# EasyEDA schematic DualGreenHat_schematic.json

## Sheets
1 Power and S3Bat
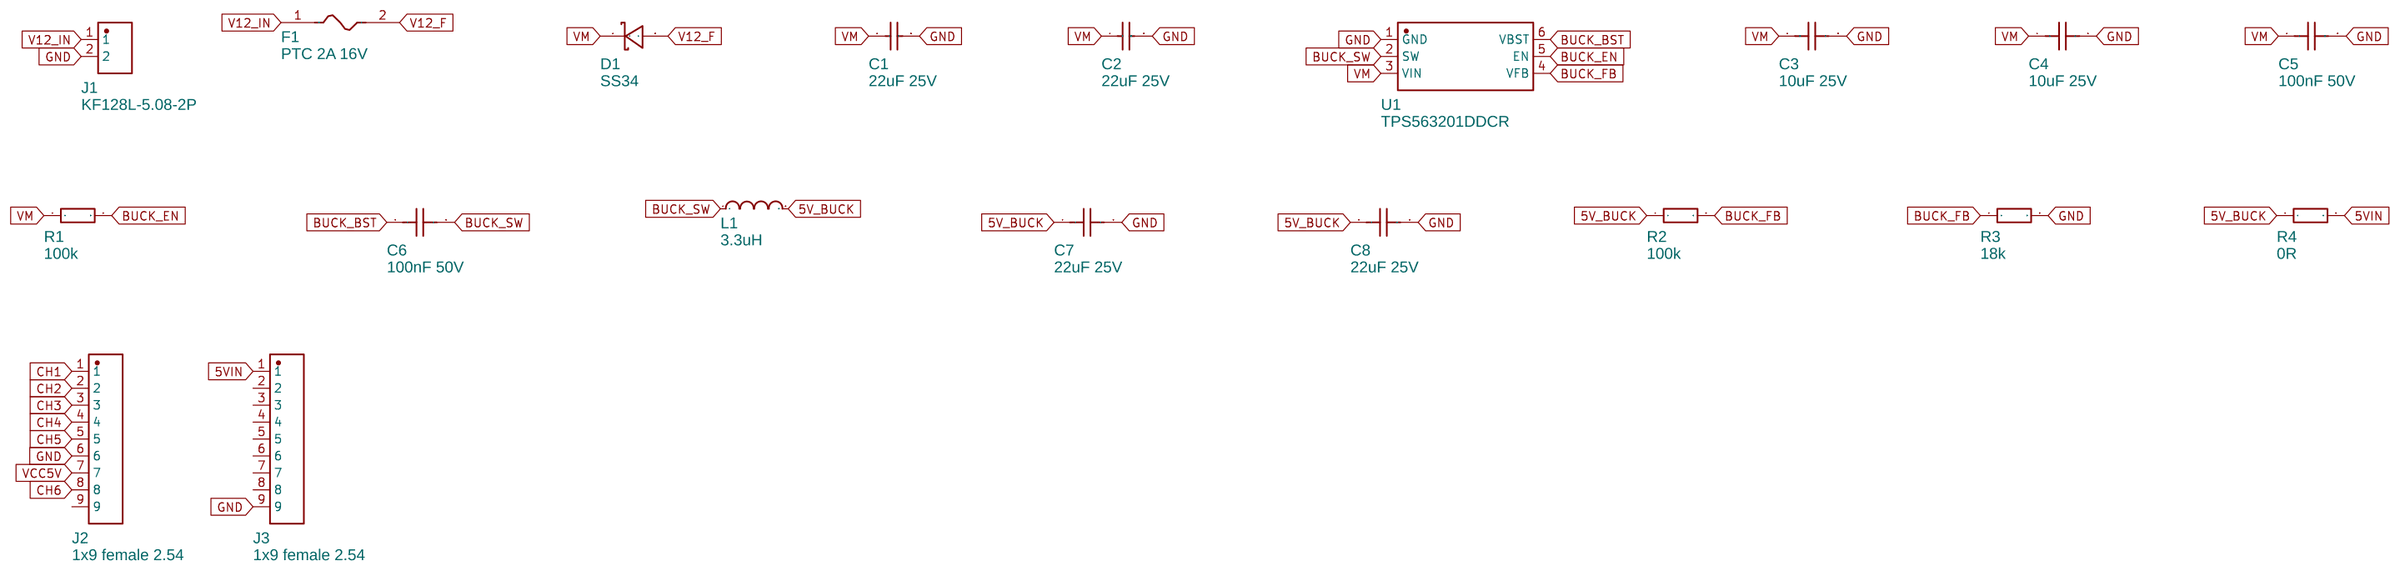
[diagram p0: Power and S3Bat]
2 Channels 1-3
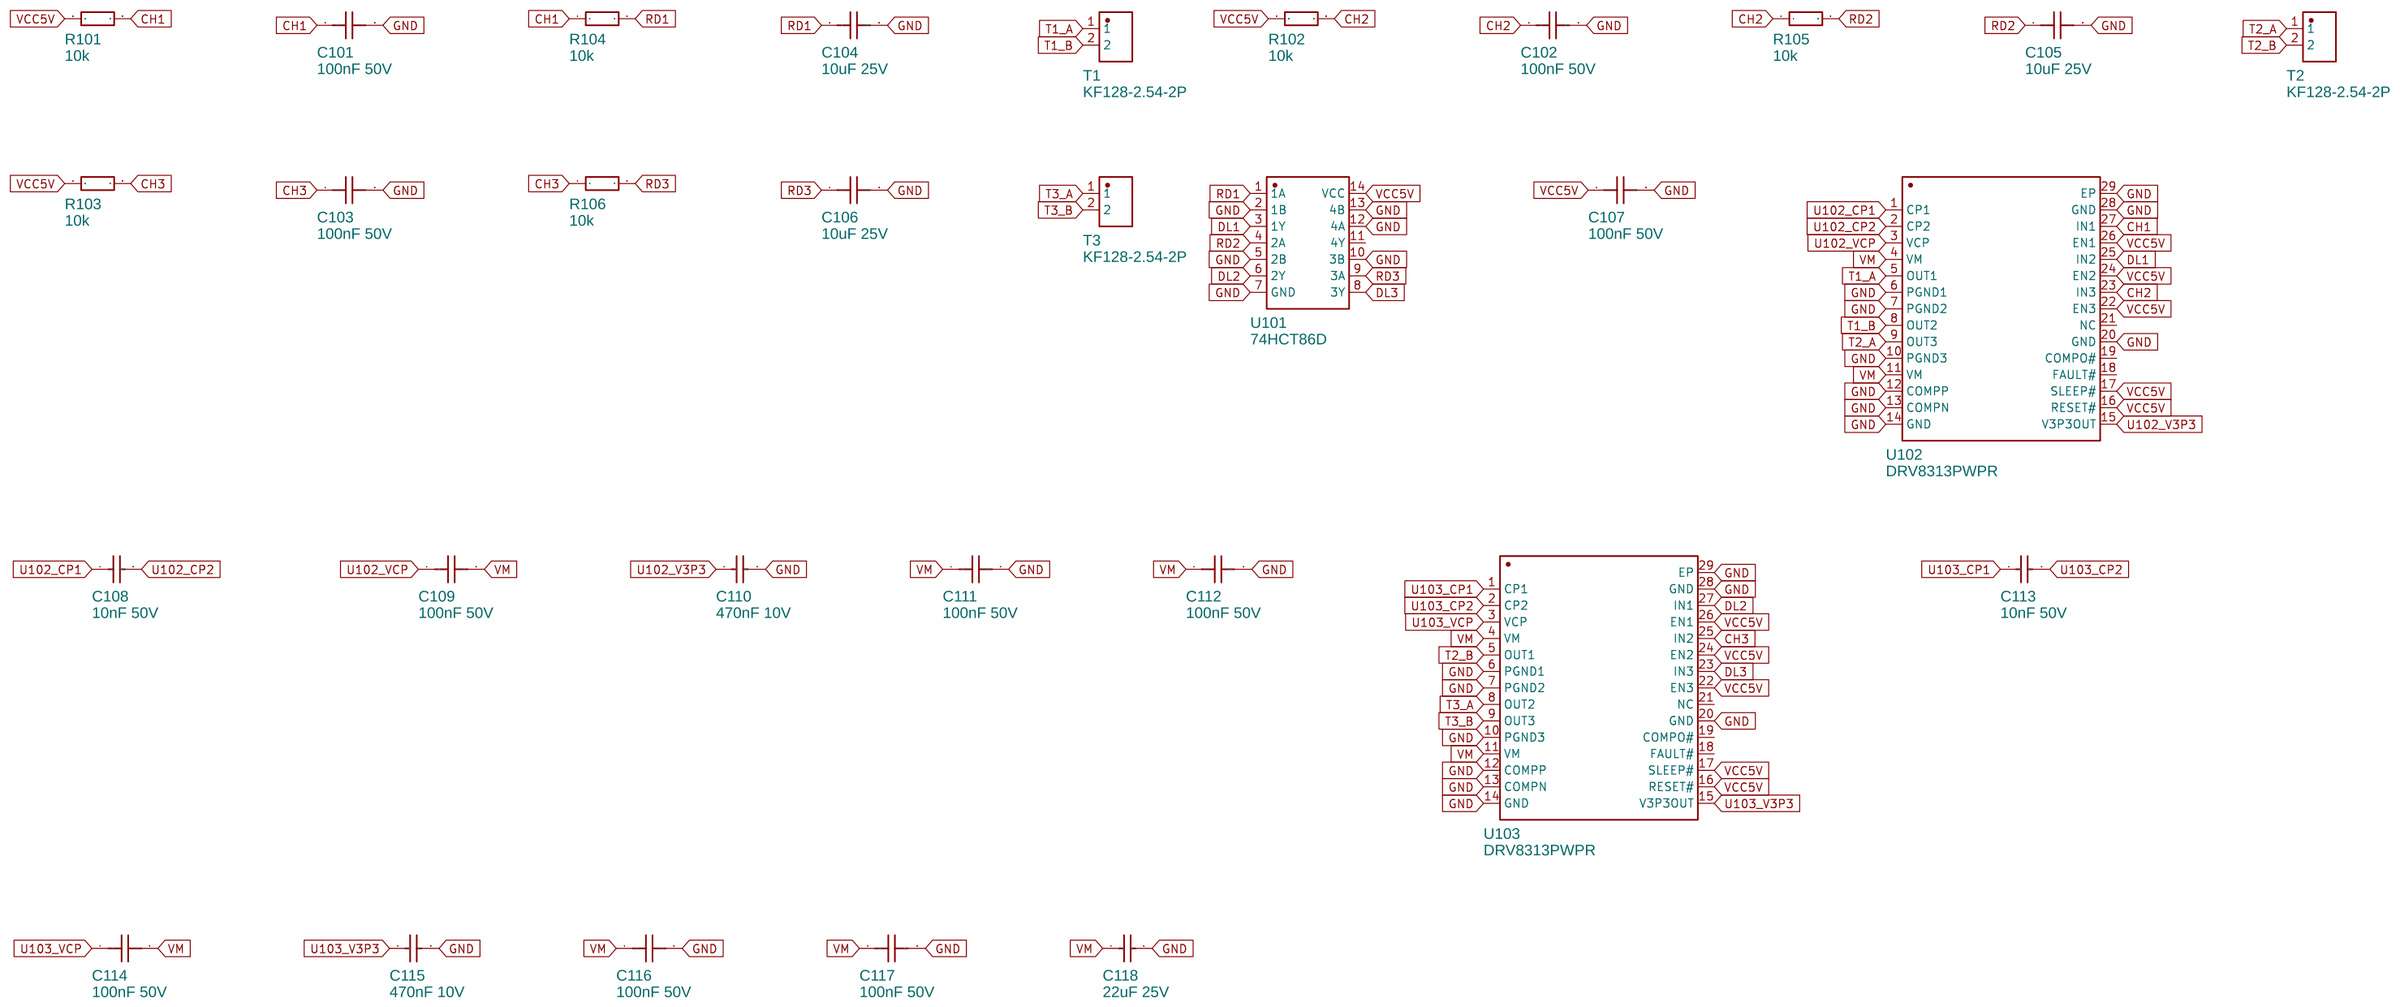
[diagram p1: Channels 1-3]
3 Channels 4-6
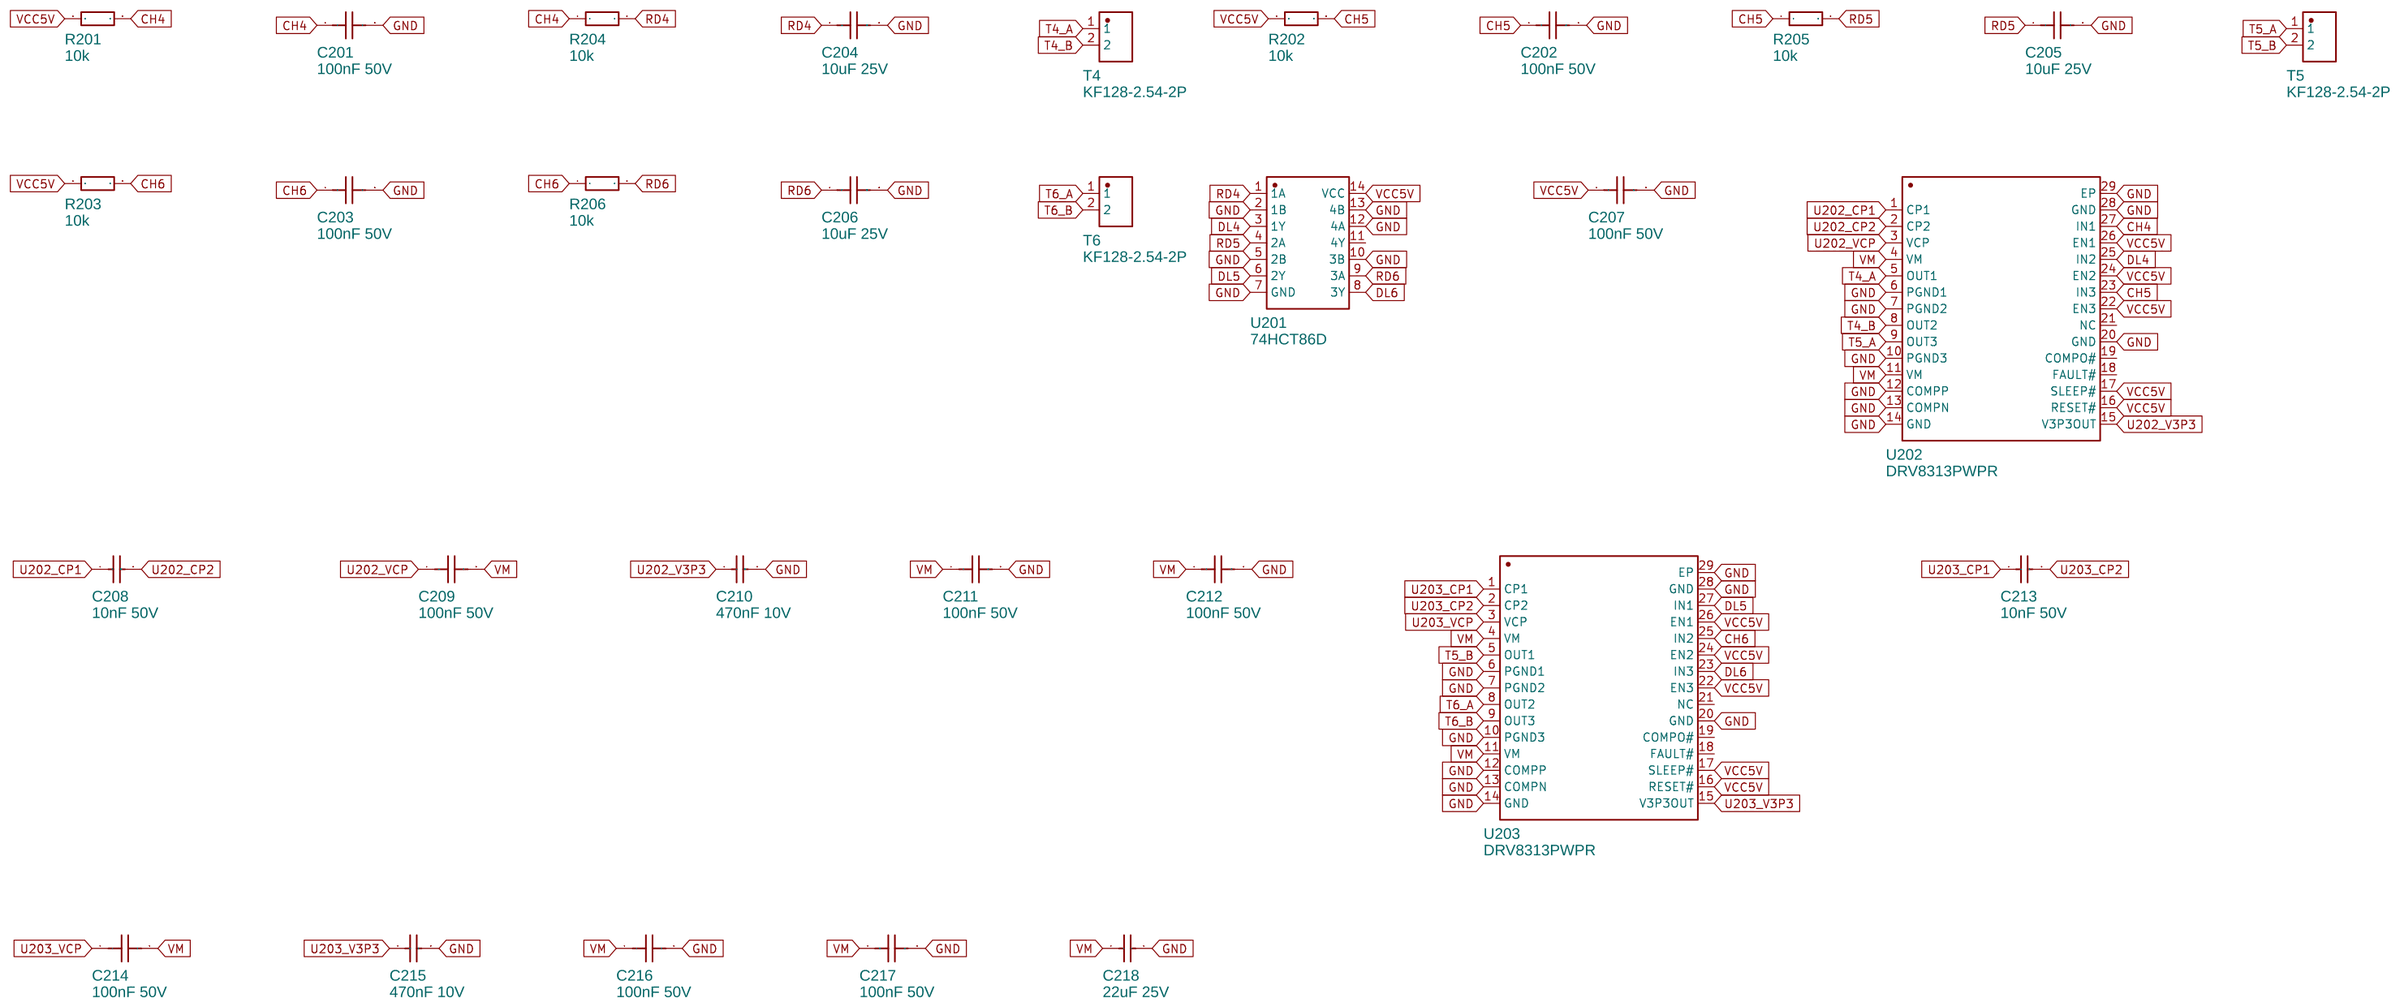
[diagram p2: Channels 4-6]

## Parts
sheet Channels 1-3
C101  100nF 50V  [C0402]
C102  100nF 50V  [C0402]
C103  100nF 50V  [C0402]
C104  10uF 25V  [C0805]
C105  10uF 25V  [C0805]
C106  10uF 25V  [C0805]
C107  100nF 50V  [C0402]
C108  10nF 50V  [C0402]
C109  100nF 50V  [C0402]
C110  470nF 10V  [C0402]
C111  100nF 50V  [C0402]
C112  100nF 50V  [C0402]
C113  10nF 50V  [C0402]
C114  100nF 50V  [C0402]
C115  470nF 10V  [C0402]
C116  100nF 50V  [C0402]
C117  100nF 50V  [C0402]
C118  22uF 25V  [C1206]
R101  10k  [R0402]
R102  10k  [R0402]
R103  10k  [R0402]
R104  10k  [R0402]
R105  10k  [R0402]
R106  10k  [R0402]
T1  KF128-2.54-2P  [CONN-TH_P2.54_KF128-2.54-2P]
T2  KF128-2.54-2P  [CONN-TH_P2.54_KF128-2.54-2P]
T3  KF128-2.54-2P  [CONN-TH_P2.54_KF128-2.54-2P]
U101  74HCT86D  [SOIC-14_L8.7-W3.9-P1.27-LS6.0-BL]
U102  DRV8313PWPR  [HTSSOP-28_L9.8-W4.5-P0.65-LS6.6-BL-EP]
U103  DRV8313PWPR  [HTSSOP-28_L9.8-W4.5-P0.65-LS6.6-BL-EP]
sheet Channels 4-6
C201  100nF 50V  [C0402]
C202  100nF 50V  [C0402]
C203  100nF 50V  [C0402]
C204  10uF 25V  [C0805]
C205  10uF 25V  [C0805]
C206  10uF 25V  [C0805]
C207  100nF 50V  [C0402]
C208  10nF 50V  [C0402]
C209  100nF 50V  [C0402]
C210  470nF 10V  [C0402]
C211  100nF 50V  [C0402]
C212  100nF 50V  [C0402]
C213  10nF 50V  [C0402]
C214  100nF 50V  [C0402]
C215  470nF 10V  [C0402]
C216  100nF 50V  [C0402]
C217  100nF 50V  [C0402]
C218  22uF 25V  [C1206]
R201  10k  [R0402]
R202  10k  [R0402]
R203  10k  [R0402]
R204  10k  [R0402]
R205  10k  [R0402]
R206  10k  [R0402]
T4  KF128-2.54-2P  [CONN-TH_P2.54_KF128-2.54-2P]
T5  KF128-2.54-2P  [CONN-TH_P2.54_KF128-2.54-2P]
T6  KF128-2.54-2P  [CONN-TH_P2.54_KF128-2.54-2P]
U201  74HCT86D  [SOIC-14_L8.7-W3.9-P1.27-LS6.0-BL]
U202  DRV8313PWPR  [HTSSOP-28_L9.8-W4.5-P0.65-LS6.6-BL-EP]
U203  DRV8313PWPR  [HTSSOP-28_L9.8-W4.5-P0.65-LS6.6-BL-EP]
sheet Power and S3Bat
C1  22uF 25V  [C1206]
C2  22uF 25V  [C1206]
C3  10uF 25V  [C0805]
C4  10uF 25V  [C0805]
C5  100nF 50V  [C0402]
C6  100nF 50V  [C0402]
C7  22uF 25V  [C0805]
C8  22uF 25V  [C0805]
D1  SS34  [SMA_L4.3-W2.6-LS5.2-RD]
F1  PTC 2A 16V  [F1812]
J1  KF128L-5.08-2P  [CONN-TH_P5.08_KF128L-5.08-2P]
J2  1x9 female 2.54  [HDR-TH_9P-P2.54-V-F-1]
J3  1x9 female 2.54  [HDR-TH_9P-P2.54-V-F-1]
L1  3.3uH  [IND-SMD_L4.0-W4.0_SMNR4012]
R1  100k  [R0402]
R2  100k  [R0402]
R3  18k  [R0603]
R4  0R  [R0805]
U1  TPS563201DDCR  [SOT-23-6_L2.9-W1.6-P0.95-LS2.8-BR]

## Library data of the parts
C5 C6 C101-C103 C107 C109 C111 C112 C114 C116 C117 C201-C203 C207 C209 C211 C212 C214 C216 C217 = CL05B104KB54PNC: Supplier: LCSC; Supplier Part: C307331; Manufacturer: SAMSUNG(三星); JLCPCB Part Class: Basic Part
C3 C4 C104-C106 C204-C206 = CL21A106KAYNNNE: Supplier: LCSC; Supplier Part: C15850; Manufacturer: SAMSUNG(三星); JLCPCB Part Class: Basic Part
C108 C113 C208 C213 = CL05B103KB5NNNC: Supplier: LCSC; Supplier Part: C15195; Manufacturer: SAMSUNG(三星); JLCPCB Part Class: Basic Part
C110 C115 C210 C215 = CL05A474KP5NNNC: Supplier: LCSC; Supplier Part: C47339; Manufacturer: SAMSUNG(三星); JLCPCB Part Class: Extended Part
C1 C2 C118 C218 = CL31A226KAHNNNE: Supplier: LCSC; Supplier Part: C12891; Manufacturer: SAMSUNG(三星); JLCPCB Part Class: Basic Part
R101-R106 R201-R206 = 0402WGF1002TCE: Supplier: LCSC; Supplier Part: C25744; Manufacturer: UNI-ROYAL(厚声); JLCPCB Part Class: Basic Part
T1-T6 = KF128-2.54-2P: Supplier: LCSC; Supplier Part: C474920; Manufacturer: KEFA(科发); JLCPCB Part Class: Extended Part
U101 U201 = 74HCT86D,653: Supplier: LCSC; Supplier Part: C6005; Manufacturer: Nexperia(安世); JLCPCB Part Class: Extended Part
U102 U103 U202 U203 = DRV8313PWPR: Supplier: LCSC; Supplier Part: C92482; Manufacturer: TI(德州仪器); JLCPCB Part Class: Extended Part
C7 C8 = CL21A226MAQNNNE: Supplier: LCSC; Supplier Part: C45783; Manufacturer: SAMSUNG(三星); JLCPCB Part Class: Basic Part
D1 = SS34: Supplier: LCSC; Supplier Part: C8678; Manufacturer: MDD(辰达半导体); JLCPCB Part Class: Basic Part
F1 = SMD1812P200TF16: Supplier: LCSC; Supplier Part: C20812; Manufacturer: RUILON(瑞隆源); JLCPCB Part Class: Extended Part
J1 = KF128L-5.08-2P: Supplier: LCSC; Supplier Part: C474940; Manufacturer: KEFA(科发); JLCPCB Part Class: Extended Part
J2 J3 = HX PM2.54-1x9P ZC-Y: Supplier: LCSC; Supplier Part: C22438159; Manufacturer: hanxia(韩下); JLCPCB Part Class: Extended Part
L1 = SWPA4030S3R3MT: Supplier: LCSC; Supplier Part: C15269; Manufacturer: Sunlord(顺络); JLCPCB Part Class: Extended Part
R1 R2 = 0402WGF1003TCE: Supplier: LCSC; Supplier Part: C25741; Manufacturer: UNI-ROYAL(厚声); JLCPCB Part Class: Basic Part
R3 = 0603WAF1802T5E: Supplier: LCSC; Supplier Part: C25810; Manufacturer: UNI-ROYAL(厚声); JLCPCB Part Class: Basic Part
R4 = 0805W8F0000T5E: Supplier: LCSC; Supplier Part: C17477; Manufacturer: UNI-ROYAL(厚声); JLCPCB Part Class: Basic Part
U1 = TPS563201DDCR: Supplier: LCSC; Supplier Part: C116592; Manufacturer: TI(德州仪器); JLCPCB Part Class: Extended Part

## Nets
5V_BUCK: C7.1 C8.1 L1.2 R2.1 R4.1
5VIN: J3.1 R4.2
GND: C1.2 C2.2 C3.2 C4.2 C5.2 C7.2 C8.2 C101.2 C102.2 C103.2 C104.2 C105.2 C106.2 C107.2 C110.2 C111.2 C112.2 C115.2 C116.2 C117.2 C118.2 C201.2 C202.2 C203.2 C204.2 C205.2 C206.2 C207.2 C210.2 C211.2 C212.2 C215.2 C216.2 C217.2 C218.2 J1.2 J2.6 J3.9 R3.2 U1.1(GND) U101.2(1B) U101.5(2B) U101.7(GND) U101.10(3B) U101.12(4A) U101.13(4B) U102.6(PGND1) U102.7(PGND2) U102.10(PGND3) U102.12(COMPP) U102.13(COMPN) U102.14(GND) U102.20(GND) U102.28(GND) U102.29(EP) U103.6(PGND1) U103.7(PGND2) U103.10(PGND3) U103.12(COMPP) U103.13(COMPN) U103.14(GND) U103.20(GND) U103.28(GND) U103.29(EP) U201.2(1B) U201.5(2B) U201.7(GND) U201.10(3B) U201.12(4A) U201.13(4B) U202.6(PGND1) U202.7(PGND2) U202.10(PGND3) U202.12(COMPP) U202.13(COMPN) U202.14(GND) U202.20(GND) U202.28(GND) U202.29(EP) U203.6(PGND1) U203.7(PGND2) U203.10(PGND3) U203.12(COMPP) U203.13(COMPN) U203.14(GND) U203.20(GND) U203.28(GND) U203.29(EP)
V12_F: D1.2(A) F1.2
V12_IN: F1.1 J1.1
VCC5V: C107.1 C207.1 J2.7 R101.1 R102.1 R103.1 R201.1 R202.1 R203.1 U101.14(VCC) U102.16(RESET#) U102.17(SLEEP#) U102.22(EN3) U102.24(EN2) U102.26(EN1) U103.16(RESET#) U103.17(SLEEP#) U103.22(EN3) U103.24(EN2) U103.26(EN1) U201.14(VCC) U202.16(RESET#) U202.17(SLEEP#) U202.22(EN3) U202.24(EN2) U202.26(EN1) U203.16(RESET#) U203.17(SLEEP#) U203.22(EN3) U203.24(EN2) U203.26(EN1)
BUCK_BST: C6.1 U1.6(VBST)
BUCK_EN: R1.2 U1.5(EN)
BUCK_FB: R2.2 R3.1 U1.4(VFB)
BUCK_SW: C6.2 L1.1 U1.2(SW)
CH1: C101.1 J2.1 R101.2 R104.1 U102.27(IN1)
CH2: C102.1 J2.2 R102.2 R105.1 U102.23(IN3)
CH3: C103.1 J2.3 R103.2 R106.1 U103.25(IN2)
CH4: C201.1 J2.4 R201.2 R204.1 U202.27(IN1)
CH5: C202.1 J2.5 R202.2 R205.1 U202.23(IN3)
CH6: C203.1 J2.8 R203.2 R206.1 U203.25(IN2)
DL1: U101.3(1Y) U102.25(IN2)
DL2: U101.6(2Y) U103.27(IN1)
DL3: U101.8(3Y) U103.23(IN3)
DL4: U201.3(1Y) U202.25(IN2)
DL5: U201.6(2Y) U203.27(IN1)
DL6: U201.8(3Y) U203.23(IN3)
RD1: C104.1 R104.2 U101.1(1A)
RD2: C105.1 R105.2 U101.4(2A)
RD3: C106.1 R106.2 U101.9(3A)
RD4: C204.1 R204.2 U201.1(1A)
RD5: C205.1 R205.2 U201.4(2A)
RD6: C206.1 R206.2 U201.9(3A)
T1_A: T1.1 U102.5(OUT1)
T1_B: T1.2 U102.8(OUT2)
T2_A: T2.1 U102.9(OUT3)
T2_B: T2.2 U103.5(OUT1)
T3_A: T3.1 U103.8(OUT2)
T3_B: T3.2 U103.9(OUT3)
T4_A: T4.1 U202.5(OUT1)
T4_B: T4.2 U202.8(OUT2)
T5_A: T5.1 U202.9(OUT3)
T5_B: T5.2 U203.5(OUT1)
T6_A: T6.1 U203.8(OUT2)
T6_B: T6.2 U203.9(OUT3)
U102_CP1: C108.1 U102.1(CP1)
U102_CP2: C108.2 U102.2(CP2)
U102_V3P3: C110.1 U102.15(V3P3OUT)
U102_VCP: C109.1 U102.3(VCP)
U103_CP1: C113.1 U103.1(CP1)
U103_CP2: C113.2 U103.2(CP2)
U103_V3P3: C115.1 U103.15(V3P3OUT)
U103_VCP: C114.1 U103.3(VCP)
U202_CP1: C208.1 U202.1(CP1)
U202_CP2: C208.2 U202.2(CP2)
U202_V3P3: C210.1 U202.15(V3P3OUT)
U202_VCP: C209.1 U202.3(VCP)
U203_CP1: C213.1 U203.1(CP1)
U203_CP2: C213.2 U203.2(CP2)
U203_V3P3: C215.1 U203.15(V3P3OUT)
U203_VCP: C214.1 U203.3(VCP)
VM: C1.1 C2.1 C3.1 C4.1 C5.1 C109.2 C111.1 C112.1 C114.2 C116.1 C117.1 C118.1 C209.2 C211.1 C212.1 C214.2 C216.1 C217.1 C218.1 D1.1(K) R1.1 U1.3(VIN) U102.4(VM) U102.11(VM) U103.4(VM) U103.11(VM) U202.4(VM) U202.11(VM) U203.4(VM) U203.11(VM)

Not connected (* = marked no-connect by the designer): J2 9; J3 2 3 4 5 6 7 8; U101 11(4Y); U102 18(FAULT#) 19(COMPO#) 21(NC); U103 18(FAULT#) 19(COMPO#) 21(NC); U201 11(4Y); U202 18(FAULT#) 19(COMPO#) 21(NC); U203 18(FAULT#) 19(COMPO#) 21(NC)
